# EAGLE design TS2068-CARTRIDGE-READER-2012-Version-2 (EAGLE 5.10)
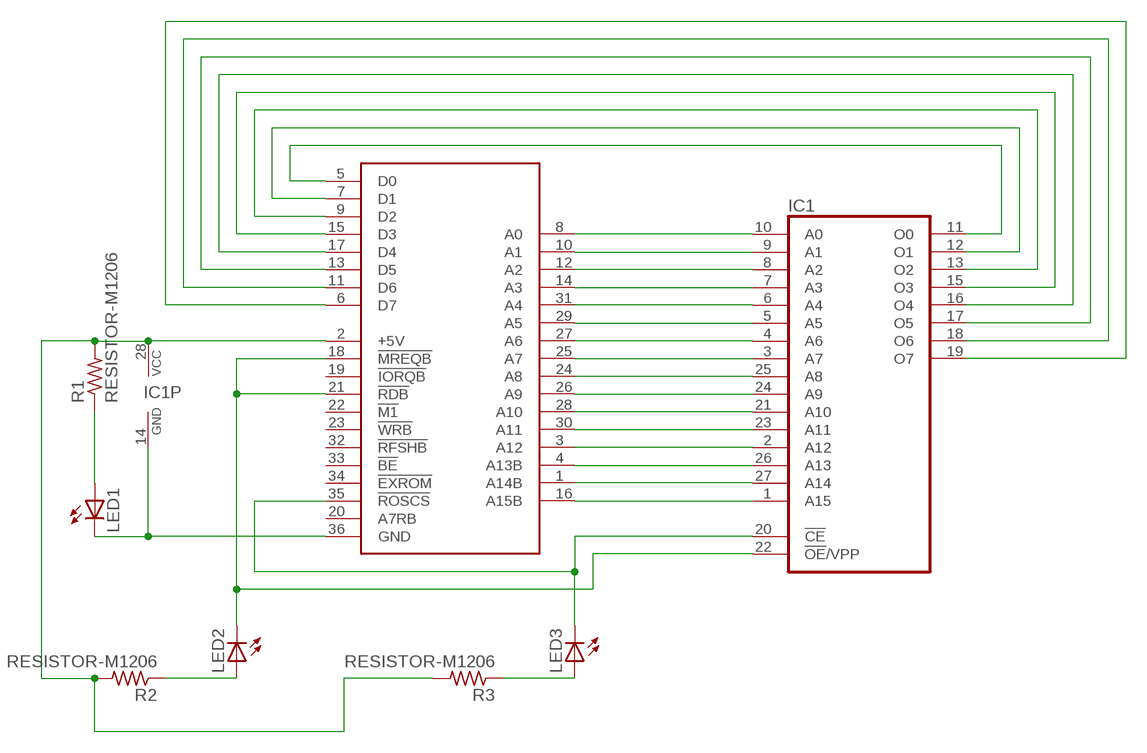
[diagram p0: schematic, sheet 1]

## Parts
IC1  27C512D-MINIMAL-OUTLINE  [DIL28-6-MINIMAL-OUTLINE]
LED1  LED3MM  [LED3MM]
LED2  LED3MM  [LED3MM]
LED3  LED3MM  [LED3MM]
R1  RESISTOR-M1206  [M1206]
R2  RESISTOR-M1206  [M1206]
R3  RESISTOR-M1206  [M1206]
TS1  TS2068-CARTRIDGE-HEADER+SLOT  [TS2068-CARTRIDGE-HEADER+SLOT]

## Nets
GND [power]: IC1.14(GND) LED1.K(C) TS1.36(GND)
N$1: IC1.10(A0) TS1.8(A0)
N$2: IC1.9(A1) TS1.10(A1)
N$3: IC1.8(A2) TS1.12(A2)
N$4: IC1.7(A3) TS1.14(A3)
N$5: IC1.6(A4) TS1.31(A4)
N$6: IC1.5(A5) TS1.29(A5)
N$7: IC1.4(A6) TS1.27(A6)
N$8: IC1.3(A7) TS1.25(A7)
N$9: IC1.25(A8) TS1.24(A8)
N$10: IC1.24(A9) TS1.26(A9)
N$11: IC1.21(A10) TS1.28(A10)
N$12: IC1.23(A11) TS1.30(A11)
N$13: IC1.2(A12) TS1.3(A12)
N$14: IC1.26(A13) TS1.4(A13B)
N$15: IC1.27(A14) TS1.1(A14B)
N$16: IC1.1(A15) TS1.16(A15B)
N$17: IC1.20(!CE) LED3.K(C) TS1.35(!ROSCS)
N$18: IC1.11(O0) TS1.5(D0)
N$19: IC1.12(O1) TS1.7(D1)
N$20: IC1.13(O2) TS1.9(D2)
N$21: IC1.15(O3) TS1.15(D3)
N$22: IC1.16(O4) TS1.17(D4)
N$23: IC1.17(O5) TS1.13(D5)
N$24: IC1.18(O6) TS1.11(D6)
N$25: IC1.19(O7) TS1.6(D7)
N$26 [power]: IC1.28(VCC) R1.2 R2.2 R3.2 TS1.2(+5V)
N$28: IC1.22(!OE!/VPP) LED2.K(C) TS1.18(!MREQB) TS1.21(!RDB)
N$29: LED3.A R3.1
N$30: LED2.A R2.1
N$32: LED1.A R1.1
Unconnected: TS1.19(!IORQB) TS1.20(A7RB) TS1.22(!M1) TS1.23(!WRB) TS1.32(!RFSHB) TS1.33(!BE) TS1.34(!EXROM)

## Library data of the parts
IC1 = GIMEchip-EPROM:27C512D: MEMORY
LED1-LED3 = GCC-CC3-AnySIMM30-0001.0:LED3MM: LED T1 (3 mm)
R1-R3 = GIMEchip-Resistor:RESISTOR
TS1 = GIMEchip-TS2068-ROM-Cartridge:TS2068-CARTRIDGE

## Net classes
0 default: width 0.254 mm, clearance 0.203 mm
1 power: width 0.762 mm, clearance 0.203 mm

## Board
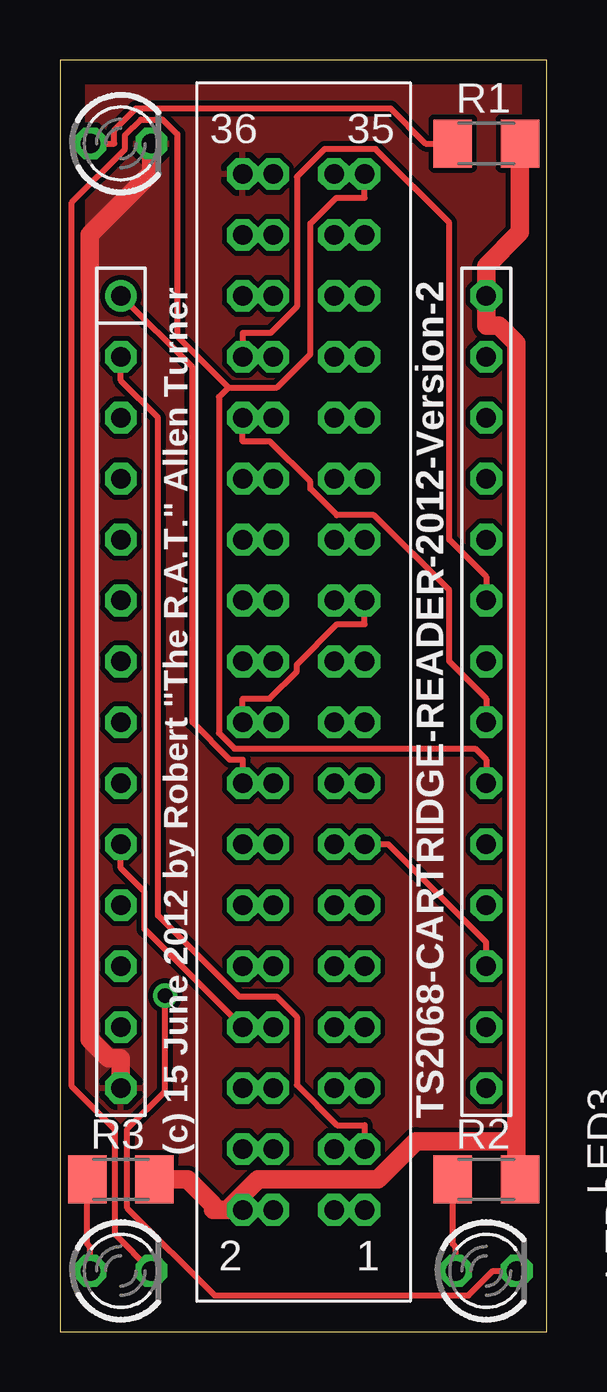
[diagram p1: board, top side]
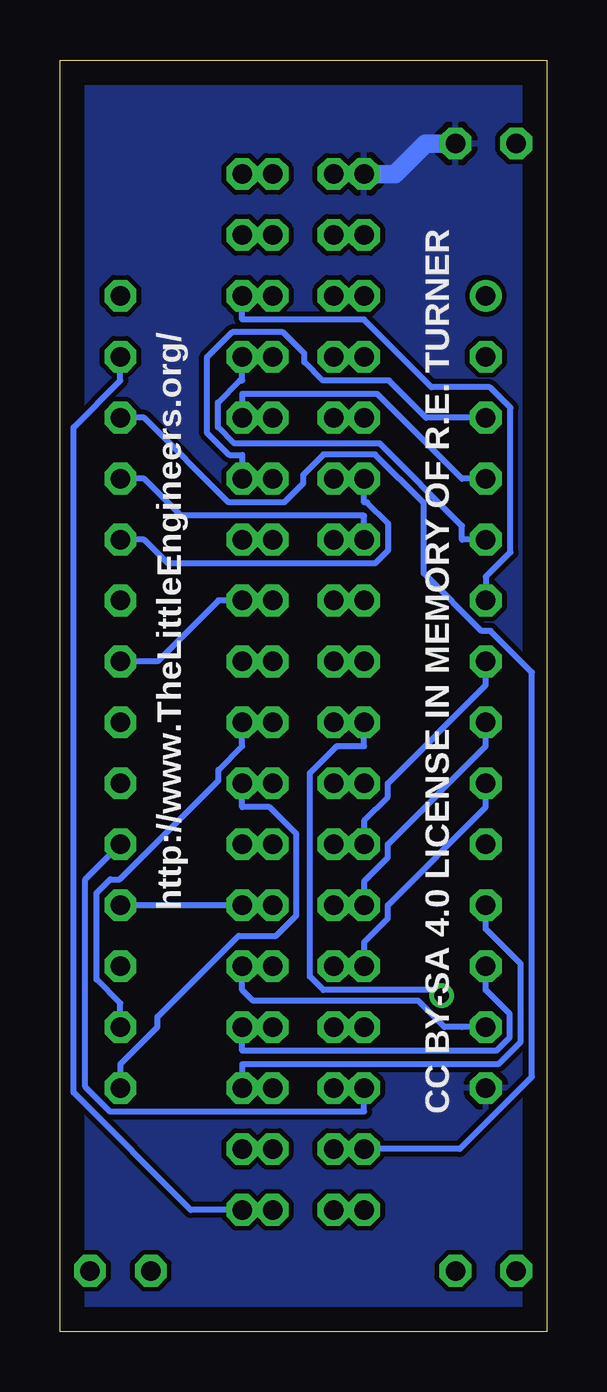
[diagram p2: board, bottom side, seen from below]

Size 20.3 x 53.01 mm. Coordinates in mm from the lower left corner, seen from the top.
Outline: 0,0 20.3,0 20.3,53.01 0,53.01 0,0
Copper layers (1*16): Top 0.035mm / dielectric 1.5mm / Bottom 0.035mm
Design rules "default": minimum track width 10mil, minimum drill 24mil, track to track 8mil, track to pad 8mil, pad to pad 8mil, via to via 8mil, smd to smd 8mil, copper to edge 40mil, drill to drill 8mil, minimum pad ring 10mil, minimum via ring 8mil, stop-mask expansion 4mil, vias tented up to drill 0mil, thermal gap 10mil

### Footprints (pad centres in the part's own frame; a part is rotated, then mirrored left to right if it is on the bottom)
DIL28-6-MINIMAL-OUTLINE = drill 0.813 round: 1 -16.51,-7.62 | drill 0.813 octagon: 2 -13.97,-7.62; 3 -11.43,-7.62; 4 -8.89,-7.62; 5 -6.35,-7.62; 6 -3.81,-7.62; 7 -1.27,-7.62; 8 1.27,-7.62; 9 3.81,-7.62; 10 6.35,-7.62; 11 8.89,-7.62; 12 11.43,-7.62; 13 13.97,-7.62; 14 16.51,-7.62; 15 16.51,7.62; 16 13.97,7.62; 17 11.43,7.62; 18 8.89,7.62; 19 6.35,7.62; 20 3.81,7.62; 21 1.27,7.62; 22 -1.27,7.62; 23 -3.81,7.62; 24 -6.35,7.62; 25 -8.89,7.62; 26 -11.43,7.62; 27 -13.97,7.62; 28 -16.51,7.62
LED3MM = drill 0.813 octagon: A -1.27,0; K 1.27,0
M1206 = smd 1.6 x 2: 1 -1.4,0; 2 1.4,0
TS2068-CARTRIDGE-HEADER+SLOT = drill 0.813 octagon: 1 2.54,-21.59; 2 -2.54,-21.59; 3 2.54,-19.05; 4 -2.54,-19.05; 5 2.54,-16.51; 6 -2.54,-16.51; 7 2.54,-13.97; 8 -2.54,-13.97; 9 2.54,-11.43; 10 -2.54,-11.43; 11 2.54,-8.89; 12 -2.54,-8.89; 13 2.54,-6.35; 14 -2.54,-6.35; 15 2.54,-3.81; 16 -2.54,-3.81; 17 2.54,-1.27; 18 -2.54,-1.27; 19 2.54,1.27; 20 -2.54,1.27; 21 2.54,3.81; 22 -2.54,3.81; 23 2.54,6.35; 24 -2.54,6.35; 25 2.54,8.89; 26 -2.54,8.89; 27 2.54,11.43; 28 -2.54,11.43; 29 2.54,13.97; 30 -2.54,13.97; 31 2.54,16.51; 32 -2.54,16.51; 33 2.54,19.05; 34 -2.54,19.05; 35 2.54,21.59; 36 -2.54,21.59; 41 1.27,-21.59; 42 -1.27,-21.59; 43 1.27,-19.05; 44 -1.27,-19.05; 45 1.27,-16.51; 46 -1.27,-16.51; 47 1.27,-13.97; 48 -1.27,-13.97; 49 1.27,-11.43; 50 -1.27,-11.43; 51 1.27,-8.89; 52 -1.27,-8.89; 53 1.27,-6.35; 54 -1.27,-6.35; 55 1.27,-3.81; 56 -1.27,-3.81; 57 1.27,-1.27; 58 -1.27,-1.27; 59 1.27,1.27; 60 -1.27,1.27; 61 1.27,3.81; 62 -1.27,3.81; 63 1.27,6.35; 64 -1.27,6.35; 65 1.27,8.89; 66 -1.27,8.89; 67 1.27,11.43; 68 -1.27,11.43; 69 1.27,13.97; 70 -1.27,13.97; 71 1.27,16.51; 72 -1.27,16.51; 73 1.27,19.05; 74 -1.27,19.05; 75 1.27,21.59; 76 -1.27,21.59

### Placement (x,y rotation side)
IC1  10.16,26.67 270 top
LED1  2.54,49.53 0 top
LED2  17.78,2.54 0 top
LED3  2.54,2.54 0 top
R1  17.78,49.53 0 top
R2  17.78,6.35 0 top
R3  2.54,6.35 0 top
TS1  10.16,26.67 0 top

### Tracks (layer width: path | path; a pad name or v marks a point on that pad's centre or on a via)
GND
  Top 0.762: IC1.14 2.54,11.4 2.02,11.4 1.25,12.18 1.25,45.72 3.81,48.28 LED1.K
  Bottom 0.762: LED1.K 5.05,49.53 6.33,48.26 TS1.36
  pour Top: 0,53.34 20.32,53.34 20.32,0 0,0
  pour Bottom: 0,53.34 20.32,53.34 20.32,0 0,0
N$1
  Top 0.254: IC1.10 2.54,19.33 3.53,18.34 3.53,16.79 TS1.8
N$2
  Bottom 0.254: IC1.9 2.54,21.87 6.63,17.78 6.63,17.22 7.62,16.23 TS1.10
N$3
  Bottom 0.254: IC1.8 2.54,24.41 6.63,20.32 6.63,19.76 7.62,18.77 TS1.12
N$4
  Bottom 0.254: IC1.7 2.54,26.95 6.63,22.86 6.63,22.3 7.62,21.31 TS1.14
N$5
  Bottom 0.254: IC1.6 2.54,31.47 1.52,32.49 1.52,38.51 2.37,39.37 4.8,39.37 7.62,42.19 12.7,42.19 TS1.31
N$6
  Bottom 0.254: TS1.29 12.7,39.65 12.8,39.65 13.71,38.74 13.71,37.7 13.04,37.02 6.96,37.02 3.53,33.59 3.53,33.02 IC1.5
N$7
  Bottom 0.254: IC1.4 3.53,35.56 7.06,39.09 12.7,39.09 TS1.27
N$8
  Bottom 0.254: TS1.25 12.7,36.55 13.24,36.55 14.18,37.48 14.18,40.6 13.12,41.66 10.99,41.66 10.11,40.78 10.11,40.41 9.35,39.65 6.58,39.65 5.03,38.1 IC1.3
N$9
  Bottom 0.254: IC1.25 16.79,35.56 15.24,34.01 7.62,34.01 TS1.24
N$10
  Bottom 0.254: IC1.24 16.79,33.02 15.79,32.02 7.16,32.02 6.61,32.58 6.61,33.68 7.5,34.57 7.62,34.57 TS1.26
N$11
  Top 0.254: IC1.21 17.78,26.39 16.23,27.94 16.23,30.91 13.1,34.03 11.55,34.03 10.44,35.15 10.44,35.43 8.76,37.11 7.62,37.11 TS1.28
N$12
  Top 0.254: IC1.23 17.78,31.47 16.23,33.02 16.23,46.23 13.16,49.29 11.04,49.29 9.88,48.14 9.88,42.73 8.78,41.63 7.62,41.63 TS1.30
N$13
  Top 0.254: IC1.2 2.54,39.65 4.09,38.1 4.09,17.35 7.47,13.97 9.04,13.97 9.88,13.13 9.88,10.29 11.56,8.61 12.7,8.61 TS1.3
N$14
  Bottom 0.254: IC1.26 16.79,38.1 13.26,34.57 10.95,34.57 10.16,35.36 10.16,35.72 9.31,36.56 7.16,36.56 5.12,34.53 5.12,31.61 2.72,29.21 2.35,29.21 0.62,27.48 0.62,10.63 3.63,7.62 TS1.4
N$15
  Bottom 0.254: IC1.27 17.78,39.65 19.74,37.69 19.74,9.97 14.84,5.08 TS1.1
N$16
  Top 0.254: TS1.16 7.62,23.85 7.08,23.85 5.52,25.41 5.52,40.2 IC1.1
N$17
  Top 0.254: 7.03,39.36 4.89,41.5 4.89,49.92 4.28,50.53 3.38,50.53 2.72,49.87 2.72,49.3 0.49,47.07 0.49,10.23 2.3,8.42 2.3,4.05 LED3.K | 7.03,39.36 6.63,38.96 6.63,24.95 7.28,24.31 17.32,24.31 17.78,23.85 IC1.20 | 7.03,39.36 9.05,39.36 10.44,40.75 10.44,46.19 11.52,47.27 12.7,47.27 TS1.35
N$18
  Bottom 0.254: IC1.11 2.54,16.79 1.09,15.34 1.09,12.09 2.02,11.15 12.7,11.15 TS1.5
N$19
  Bottom 0.254: IC1.12 2.54,14.25 1.54,13.25 1.54,12.28 2.11,11.71 12.7,11.71 TS1.7
N$20
  Bottom 0.254: 5.35,13.79 4.26,12.7 3.53,12.7 IC1.13 | 5.35,13.79 | 5.35,13.79 12.24,13.79 12.7,14.25 TS1.9
N$21
  Bottom 0.254: IC1.15 17.78,11.15 16.23,12.7 16.23,13.13 12.85,16.51 11.28,16.51 10.44,17.35 10.44,20.75 11.56,21.87 12.7,21.87 TS1.15
N$22
  Bottom 0.254: IC1.16 17.78,13.69 18.77,14.68 18.77,18.28 18.2,18.86 17.8,18.86 13.69,22.97 13.69,23.42 12.7,24.41 TS1.17
N$23
  Top 0.254: IC1.17 17.78,16.23 13.69,20.32 TS1.13
N$24
  Bottom 0.254: TS1.11 IC1.18
N$25
  Bottom 0.254: TS1.6 7.62,9.17 18.2,9.17 19.24,10.22 19.24,18.86 IC1.19
N$26
  Top 0.762: 19.02,7.94 19.02,41.21 18.3,41.94 17.78,41.94 IC1.28 17.78,44.42 19.18,45.83 R1.2 | 19.02,7.94 19.02,6.35 R2.2 | 7,5.08 8.27,6.35 13.26,6.35 14.85,7.94 19.02,7.94 | 7,5.08 6.38,5.08 6.38,5.3 5.32,6.35 R3.2 | 7,5.08 TS1.2
N$28  (via drill 0.61 pad 1.02)
  Top 0.254: TS1.18 7.62,26.39 8.75,26.39 9.88,27.52 9.88,27.81 11.56,29.49 12.7,29.49 TS1.21 | LED2.K 18.06,2.54 17.04,1.51 6.45,1.51 2.81,5.16 2.81,8.45 4.38,10.02 v4.38,14.01
  Bottom 0.254: TS1.21 13.69,30.48 16.23,27.94 IC1.22 | v4.38,14.01 4.63,14.25 9.32,14.25 9.88,14.81 9.88,23.29 8.76,24.41 7.62,24.41 TS1.18
N$29
  Top 0.254: LED3.A 1.27,3.53 1.14,3.66 R3.1
N$30
  Top 0.254: LED2.A 16.51,3.53 16.38,3.66 R2.1
N$32
  Top 0.254: LED1.A 2.26,49.53 2.26,50.09 3.17,51 13.78,51 15.25,49.53 R1.1

### Text on the board
tPlace: TS2068-CARTRIDGE-READER-2012-Version-2 | (c) 15 June 2012 by Robert "The R.A.T." Allen Turner
bPlace: CC BY-SA 4.0 LICENSE IN MEMORY OF R.E. TURNER | http://www.TheLittleEngineers.org/